# EAGLE design main_board (EAGLE 9.6.2)
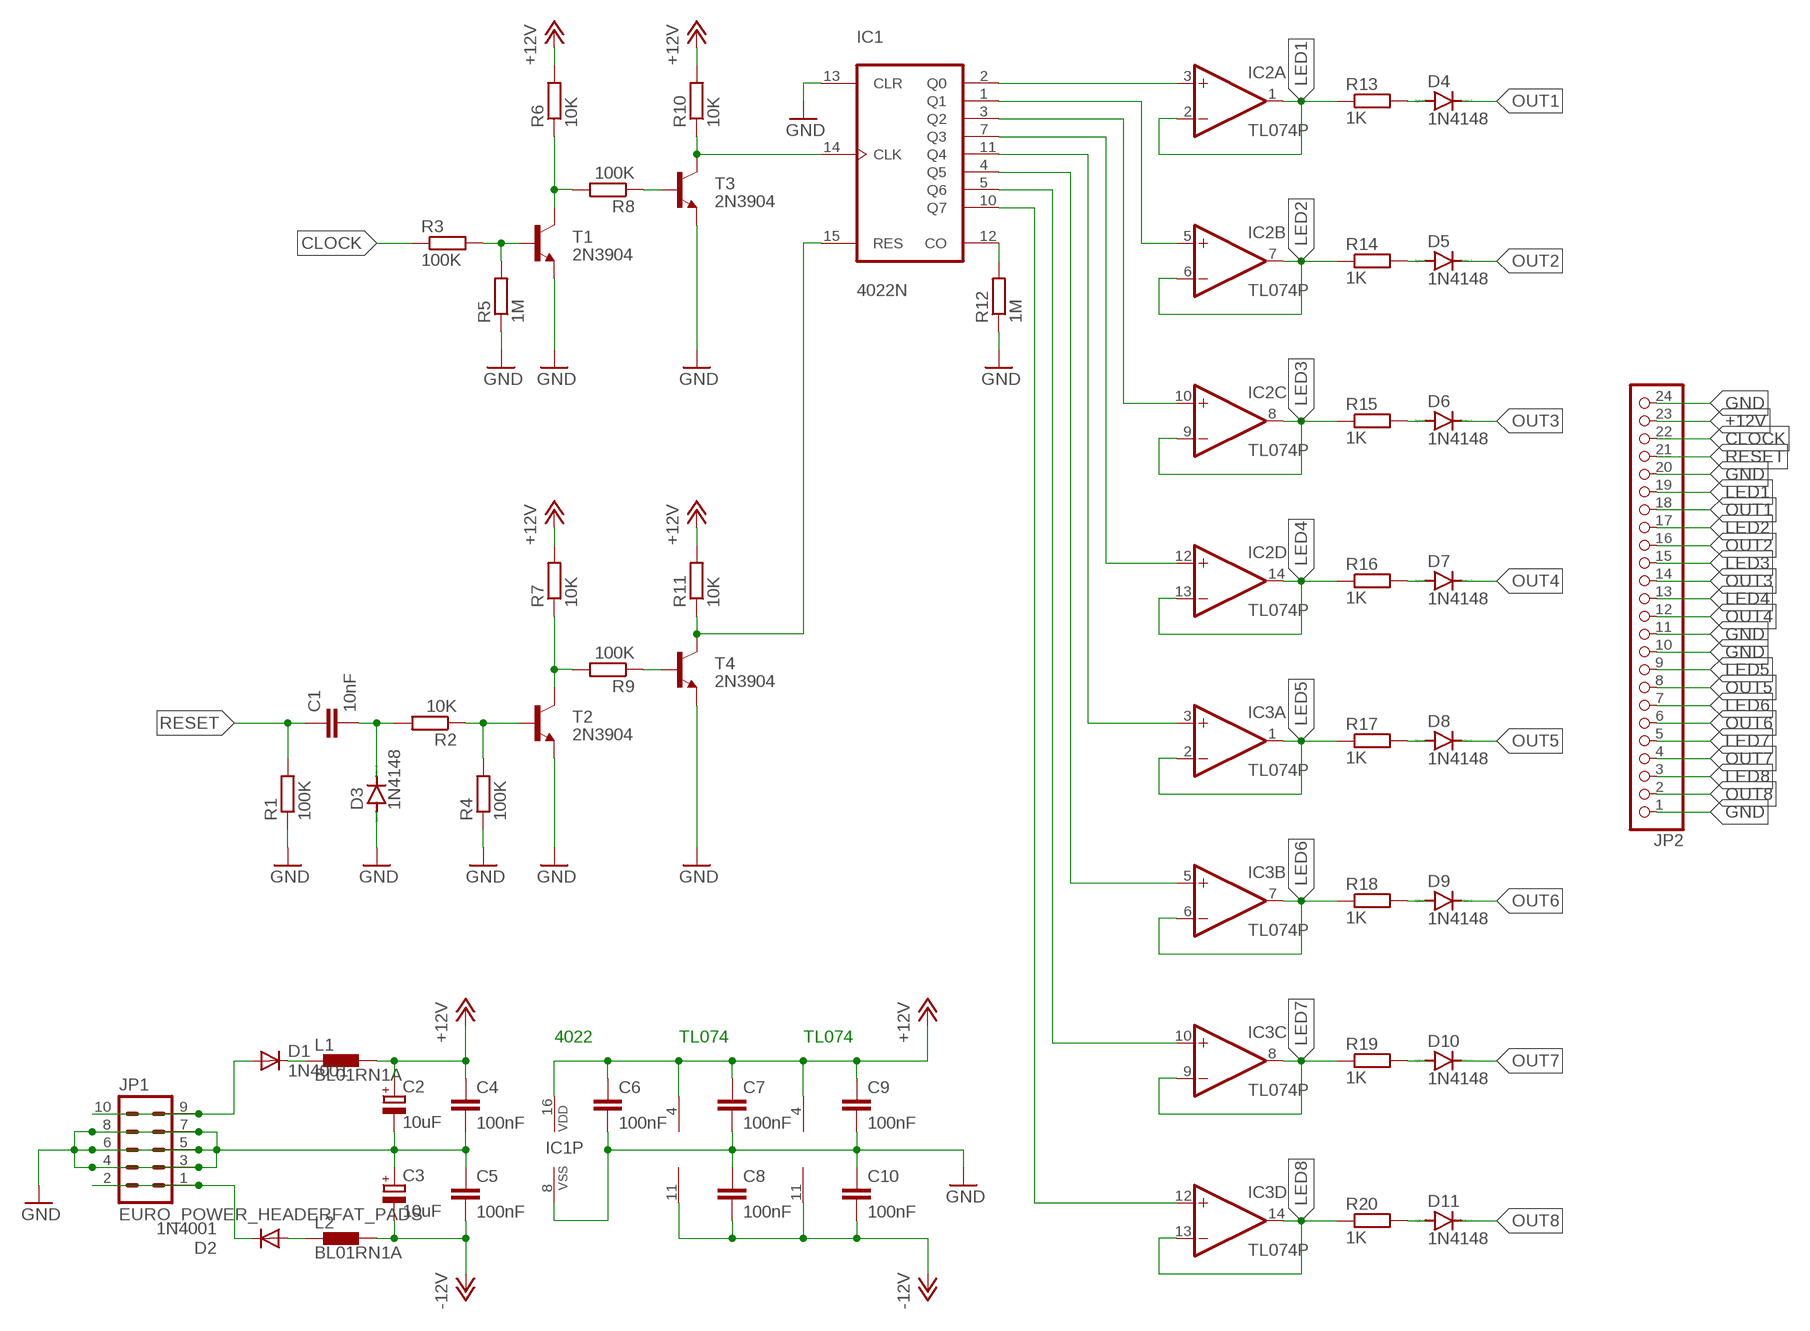
[diagram p0: schematic, sheet 1]

## Parts
C1  10nF  C-EU025-024X044  [C025-024X044]
C2  10uF  CPOL-EUE2,5-6E  [E2,5-6E]
C3  10uF  CPOL-EUE2,5-6E  [E2,5-6E]
C4  100nF  C-EU025-024X044  [C025-024X044]
C5  100nF  C-EU025-024X044  [C025-024X044]
C6  100nF  C-EU025-024X044  [C025-024X044]
C7  100nF  C-EU025-024X044  [C025-024X044]
C8  100nF  C-EU025-024X044  [C025-024X044]
C9  100nF  C-EU025-024X044  [C025-024X044]
C10  100nF  C-EU025-024X044  [C025-024X044]
D1  1N4001  1N4004  [DO41-10]
D2  1N4001  1N4004  [DO41-10]
D3  1N4148  1N4148DO35-7  [DO35-7]
D4  1N4148  1N4148DO35-7  [DO35-7]
D5  1N4148  1N4148DO35-7  [DO35-7]
D6  1N4148  1N4148DO35-7  [DO35-7]
D7  1N4148  1N4148DO35-7  [DO35-7]
D8  1N4148  1N4148DO35-7  [DO35-7]
D9  1N4148  1N4148DO35-7  [DO35-7]
D10  1N4148  1N4148DO35-7  [DO35-7]
D11  1N4148  1N4148DO35-7  [DO35-7]
IC1  4022N  [DIL16]
IC2  TL074P  [DIL14]
IC3  TL074P  [DIL14]
JP1  EURO_POWER_HEADERFAT_PADS  [EURO_PWR_HEADER_FAT]
JP2  PINHD-1X24/90  [1X24/90]
L1  BL01RN1A  [BL01RN1A]
L2  BL01RN1A  [BL01RN1A]
R1  100K  R-EU_0204/5  [0204/5]
R2  10K  R-EU_0204/5  [0204/5]
R3  100K  R-EU_0204/5  [0204/5]
R4  100K  R-EU_0204/5  [0204/5]
R5  1M  R-EU_0204/5  [0204/5]
R6  10K  R-EU_0204/5  [0204/5]
R7  10K  R-EU_0204/5  [0204/5]
R8  100K  R-EU_0204/5  [0204/5]
R9  100K  R-EU_0204/5  [0204/5]
R10  10K  R-EU_0204/5  [0204/5]
R11  10K  R-EU_0204/5  [0204/5]
R12  1M  R-EU_0204/5  [0204/5]
R13  1K  R-EU_0204/5  [0204/5]
R14  1K  R-EU_0204/5  [0204/5]
R15  1K  R-EU_0204/5  [0204/5]
R16  1K  R-EU_0204/5  [0204/5]
R17  1K  R-EU_0204/5  [0204/5]
R18  1K  R-EU_0204/5  [0204/5]
R19  1K  R-EU_0204/5  [0204/5]
R20  1K  R-EU_0204/5  [0204/5]
T1  2N3904  [TO92]
T2  2N3904  [TO92]
T3  2N3904  [TO92]
T4  2N3904  [TO92]

## Nets
+12V: C2.+ C4.1 C6.1 C7.1 C9.1 IC1.16(VDD) IC2.4(P:V+) IC3.4(P:V+) JP2.23 L1.2 R6.2 R7.2 R10.2 R11.2
-12V: C3.- C5.2 C8.2 C10.2 IC2.11(P:V-) IC3.11(P:V-) L2.2
CLOCK: JP2.22 R3.1
GND: C2.- C3.+ C4.2 C5.1 C6.2 C7.2 C8.1 C9.2 C10.1 D3.A IC1.8(VSS) IC1.13(CLR) JP1.3 JP1.4 JP1.5 JP1.6 JP1.7 JP1.8 JP2.1 JP2.10 JP2.11 JP2.20 JP2.24 R1.1 R4.1 R5.1 R12.1 T1.3(E) T2.3(E) T3.3(E) T4.3(E)
LED1: IC2.1(A:OUT) IC2.2(A:-IN) JP2.19 R13.1
LED2: IC2.6(B:-IN) IC2.7(B:OUT) JP2.17 R14.1
LED3: IC2.8(C:OUT) IC2.9(C:-IN) JP2.15 R15.1
LED4: IC2.13(D:-IN) IC2.14(D:OUT) JP2.13 R16.1
LED5: IC3.1(A:OUT) IC3.2(A:-IN) JP2.9 R17.1
LED6: IC3.6(B:-IN) IC3.7(B:OUT) JP2.7 R18.1
LED7: IC3.8(C:OUT) IC3.9(C:-IN) JP2.5 R19.1
LED8: IC3.13(D:-IN) IC3.14(D:OUT) JP2.3 R20.1
N$1: D1.A JP1.9 JP1.10
N$2: D2.C JP1.1 JP1.2
N$3: D1.C L1.1
N$4: D2.A L2.1
N$5: D4.A R13.2
N$7: D5.A R14.2
N$11: D6.A R15.2
N$16: D7.A R16.2
N$17: IC1.2(Q0) IC2.3(A:+IN)
N$18: IC1.1(Q1) IC2.5(B:+IN)
N$19: IC1.3(Q2) IC2.10(C:+IN)
N$20: IC1.7(Q3) IC2.12(D:+IN)
N$21: IC1.11(Q4) IC3.3(A:+IN)
N$22: IC1.4(Q5) IC3.5(B:+IN)
N$23: IC1.5(Q6) IC3.10(C:+IN)
N$24: IC1.10(Q7) IC3.12(D:+IN)
N$26: R3.2 R5.2 T1.2(B)
N$28: C1.2 D3.C R2.2
N$29: R2.1 R4.2 T2.2(B)
N$30: R6.1 R8.2 T1.1(C)
N$32: IC1.12(CO) R12.2
N$37: D8.A R17.2
N$41: D9.A R18.2
N$45: D10.A R19.2
N$49: D11.A R20.2
N$52: R8.1 T3.2(B)
N$53: IC1.14(CLK) R10.1 T3.1(C)
N$54: R7.1 R9.2 T2.1(C)
N$55: R9.1 T4.2(B)
N$56: IC1.15(RES) R11.1 T4.1(C)
OUT1: D4.C JP2.18
OUT2: D5.C JP2.16
OUT3: D6.C JP2.14
OUT4: D7.C JP2.12
OUT5: D8.C JP2.8
OUT6: D9.C JP2.6
OUT7: D10.C JP2.4
OUT8: D11.C JP2.2
RESET: C1.1 JP2.21 R1.2

## Notes on the sheet
- 4022 | TL074 | TL074

## Library data of the parts
C1 = rcl:C-EU: CAPACITOR, European symbol; MF: MULTICOMP; MPN: MC0805Y103M500A2.54MM; OC_FARNELL: 1694335; SPICEPREFIX: C
C2 C3 = rcl:CPOL-EU: POLARIZED CAPACITOR, European symbol; MF: RUBYCON; MPN: 35ZLG10MEFC5X7; OC_FARNELL: 1281818; SPICEPREFIX: C
C4-C10 = rcl:C-EU: CAPACITOR, European symbol; MF: EPCOS; MPN: B32529C0104J289; OC_FARNELL: 2797801; SPICEPREFIX: C
D1 D2 = diode:1N4004: DIODE general purpose rectifier, 1 A; MF: VISHAY; MPN: 1N4001-E3/54; OC_FARNELL: 2889052
D3-D11 = diode:1N4148: DIODE high speed (Philips); MF: DIODES INC.; MPN: 1N5817-T; OC_FARNELL: 3127178
IC1 = 40xx:4022: Divide-by 8 COUNTER; MF: TEXAS INSTRUMENTS; MPN: CD4022BE; OC_FARNELL: 3006269
IC2 IC3 = linear:TL074: OP AMP; MF: TEXAS INSTRUMENTS; MPN: TL074ACN; OC_FARNELL: 3117798
JP1 = MusicThingModular:EURO_POWER_HEADER: Power Header 10 pin power header for Eurorack Power Supplies Variants with fatter pads for easier soldering, and the LOCK variant which has 5mil offset pins to hold the component in place before soldering
JP2 = pinhead:PINHD-1X24: PIN HEADER
L1 L2 = inductors:BL0: Noise Suppression Products/EMI Suppression Filters, Lead EMIFIL(R) Inductor Type Source: http://www.murata.com .. BL01RN1_DS.pdf
R1 R3 R4 R8 R9 = rcl:R-EU_: RESISTOR, European symbol; MF: MULTICOMP PRO; MPN: MCF 0.25W 100K; OC_FARNELL: 9339078; SPICEPREFIX: R
R2 R6 R7 R10 R11 = rcl:R-EU_: RESISTOR, European symbol; MF: MULTICOMP PRO; MPN: MCF 0.25W 10K; OC_FARNELL: 9339060; SPICEPREFIX: R
R5 R12 = rcl:R-EU_: RESISTOR, European symbol; MF: MULTICOMP PRO; MPN: MCF 0.25W 1M; OC_FARNELL: 9339086; SPICEPREFIX: R
R13-R20 = rcl:R-EU_: RESISTOR, European symbol; MF: MULTICOMP PRO; MPN: MCF 0.25W 1K; OC_FARNELL: 9339051; SPICEPREFIX: R
T1-T4 = transistor:2N3904: NPN TRANSISTOR; MF: MULTICOMP PRO; MPN: 2N3904; OC_FARNELL: 1574370

## Net classes
1 power: width 0.406 mm
2 ground: width 0.406 mm

## Board
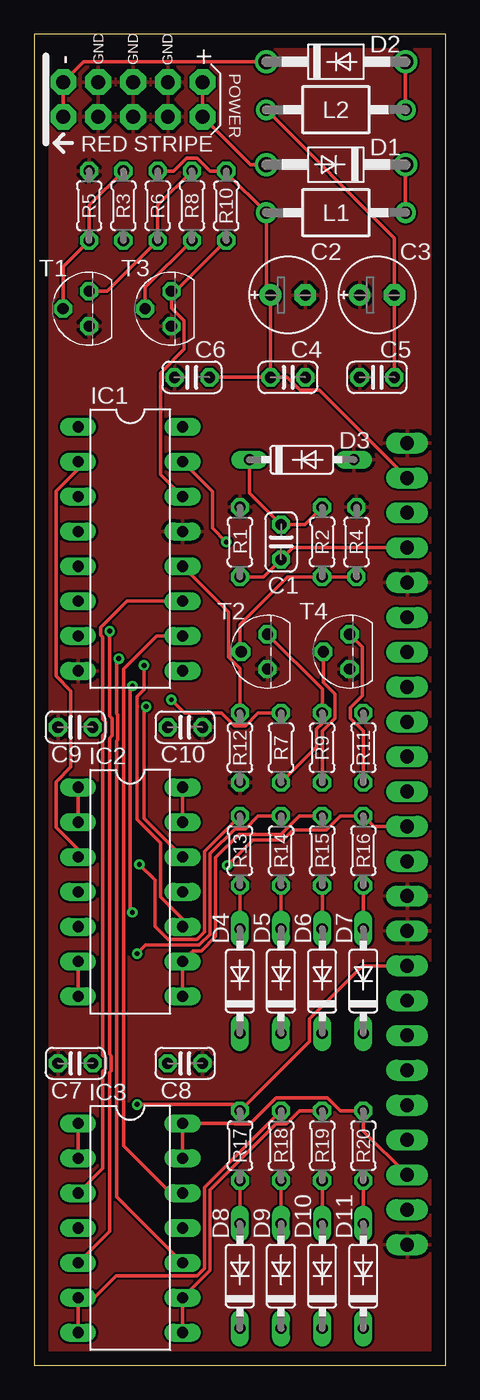
[diagram p1: board, top side]
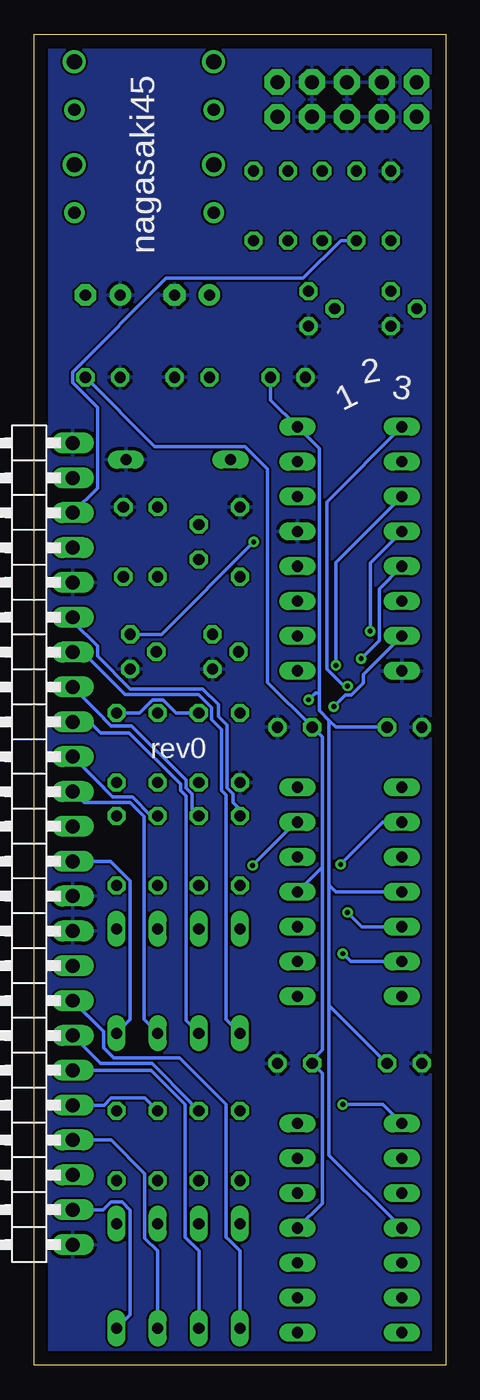
[diagram p2: board, bottom side, seen from below]

Size 30 x 97 mm. Coordinates in mm from the lower left corner, seen from the top.
Outline: 0,0 30,0 30,97 0,97 0,0
Copper layers (1*16): Top 0.035mm / dielectric 1.5mm / Bottom 0.035mm
Design rules "default *": minimum track width 6mil, minimum drill 0.35mm, track to track 6mil, track to pad 6mil, pad to pad 6mil, via to via 6mil, smd to smd 6mil, copper to edge 40mil, drill to drill 6mil, minimum pad ring 10mil, minimum via ring 8mil, stop-mask expansion 4mil, vias tented up to drill 0mil, thermal gap 10mil

### Footprints (pad centres in the part's own frame; a part is rotated, then mirrored left to right if it is on the bottom)
C025-024X044 = drill 0.813 octagon: 1 -1.27,0; 2 1.27,0
E2,5-6E = drill 0.813 pad 1.575: + -1.27,0 | drill 0.813 pad 1.575 octagon: - 1.27,0
DO41-10 = drill 1.118: A 5.08,0; C -5.08,0
DO35-7 = drill 0.813 long: A 3.81,0; C -3.81,0
DIL16 = drill 0.813 long: 1 -8.89,-3.81; 2 -6.35,-3.81; 3 -3.81,-3.81; 4 -1.27,-3.81; 5 1.27,-3.81; 6 3.81,-3.81; 7 6.35,-3.81; 8 8.89,-3.81; 9 8.89,3.81; 10 6.35,3.81; 11 3.81,3.81; 12 1.27,3.81; 13 -1.27,3.81; 14 -3.81,3.81; 15 -6.35,3.81; 16 -8.89,3.81
DIL14 = drill 0.813 long: 1 -7.62,-3.81; 2 -5.08,-3.81; 3 -2.54,-3.81; 4 0,-3.81; 5 2.54,-3.81; 6 5.08,-3.81; 7 7.62,-3.81; 8 7.62,3.81; 9 5.08,3.81; 10 2.54,3.81; 11 0,3.81; 12 -2.54,3.81; 13 -5.08,3.81; 14 -7.62,3.81
EURO_PWR_HEADER_FAT = drill 1.016 pad 1.88 octagon: 1 -5.08,-1.27; 2 -5.08,1.27; 3 -2.54,-1.27; 4 -2.54,1.27; 5 0,-1.27; 6 0,1.27; 7 2.54,-1.27; 8 2.54,1.27; 9 5.08,-1.27; 10 5.08,1.27
1X24/90 = drill 1.016 long: 1 -29.21,-3.81; 2 -26.67,-3.81; 3 -24.13,-3.81; 4 -21.59,-3.81; 5 -19.05,-3.81; 6 -16.51,-3.81; 7 -13.97,-3.81; 8 -11.43,-3.81; 9 -8.89,-3.81; 10 -6.35,-3.81; 11 -3.81,-3.81; 12 -1.27,-3.81; 13 1.27,-3.81; 14 3.81,-3.81; 15 6.35,-3.81; 16 8.89,-3.81; 17 11.43,-3.81; 18 13.97,-3.81; 19 16.51,-3.81; 20 19.05,-3.81; 21 21.59,-3.81; 22 24.13,-3.81; 23 26.67,-3.81; 24 29.21,-3.81
BL01RN1A = drill 0.9 pad 1.5: 1 -5.08,0; 2 5.08,0
0204/5 = drill 0.813 octagon: 1 -2.54,0; 2 2.54,0
TO92 = drill 0.813 octagon: 1 1.27,0; 2 0,1.905; 3 -1.27,0

### Placement (x,y rotation side)
C1  18,60 90 top
C2  18.5,78 0 top
C3  25,78 0 top
C4  18.5,72 0 top
C5  25,72 0 top
C6  11.5,72 180 top
C7  3,22 180 top
C8  11,22 180 top
C9  3,46.5 180 top
C10  11,46.5 180 top
D1  22,87.5 180 top
D2  22,95 0 top
D3  19.5,66 0 top
D4  15,28 90 top
D5  18,28 90 top
D6  21,28 90 top
D7  24,28 90 top
D8  15,6.5 90 top
D9  18,6.5 90 top
D10  21,6.5 90 top
D11  24,6.5 90 top
IC1  7,59.5 270 top
IC2  7,34.5 270 top
IC3  7,10 270 top
JP1  7.2,92.25 0 top
JP2  31,38 90 bottom
L1  22,84 180 top
L2  22,91.5 180 top
R1  15,60 270 top
R2  21,60 90 top
R3  6.5,84.5 90 top
R4  23.5,60 270 top
R5  4,84.5 270 top
R6  9,84.5 90 top
R7  18,45 90 top
R8  11.5,84.5 90 top
R9  21,45 90 top
R10  14,84.5 90 top
R11  24,45 90 top
R12  15,45 90 top
R13  15,37.5 270 top
R14  18,37.5 270 top
R15  21,37.5 270 top
R16  24,37.5 270 top
R17  15,16 270 top
R18  18,16 270 top
R19  21,16 270 top
R20  24,16 270 top
T1  4,77 90 top
T2  17,52 90 top
T3  10,77 90 top
T4  23,52 90 top

### Tracks (layer width: path | path; a pad name or v marks a point on that pad's centre or on a via)
+12V  (via drill 0.35)
  Top 0.254: R6.2 10.17,87.04 11.11,87.98 11.89,87.98 12.83,87.04 R10.2 14,86.92 L1.2 16.92,78.31 C2.+ C4.1 | C4.1 C6.1 | JP2.23 20.8,71.06 19.38,71.06 18.44,72 C4.1 | v10,48.5 10.96,47.54 13.67,47.54 14.61,46.6 15.39,46.6 16.33,47.54 R7.2
  Bottom 0.254: R7.2 19.67,47.54 20.61,48.48 21.39,48.48 22.33,47.54 R11.2 | IC3.4 8.5,15.31 8.5,26.23 | 8.5,47 8.5,35 | 8.5,35 8.5,26.23 | C7.1 8.5,26.23 | C9.1 8,46.5 8.5,47 | 8.5,47 9.21,47.71 9.21,49 | C6.1 12.77,70.35 IC1.16 9.21,66.79 9.21,49 | IC2.4 8,34.5 8.5,35 | v10,48.5 9.5,49 9.21,49
-12V
  Top 0.254: L2.2 26.27,82.15 C3.- C5.2
  Bottom 0.254: IC3.11 9,11.81 9,21.27 C8.2 9.73,22.27 9,23 9,36.31 | 9,36.31 9,45.77 C10.2 13,49.77 13,65.3 14.64,66.94 21.21,66.94 C5.2 | IC2.11 9,36.31
CLOCK
  Bottom 0.254: R3.1 7.64,81.96 10.39,79.21 20.39,79.21 27.21,72.39 27.21,71.61 25.39,69.79 25.39,63.93 JP2.22
GND
  pour Top: -1,98 -1,-1 31,-1 31,98
  pour Bottom: -1,98 -1,-1 31,-1 31,98
LED1  (via drill 0.35)
  Top 0.254: IC2.2 IC2.1 | v7.66,36.5 8.8,35.35 8.8,31.98 9.76,31.02 11.86,31.02 12.41,31.57 12.41,37.45 R13.1
  Bottom 0.254: IC2.2 4.58,39.58 v7.66,36.5 | R13.1 15,40.5 15.5,41 15.5,41.63 15.94,42.07 15.94,46.65 16.56,47.27 16.56,48.14 17.72,49.29 23,49.29 25.39,51.68 25.39,52.4 27.19,54.2 JP2.19
LED2  (via drill 0.35)
  Top 0.254: IC2.6 IC2.7 | v7.5,30 8.11,30.61 12.03,30.61 12.82,31.4 12.82,37.28 14.63,39.1 15.39,39.1 16.33,40.04 R14.1
  Bottom 0.254: IC2.6 6.92,29.42 v7.5,30 | R14.1 18.5,40.54 18.5,41.63 18.94,42.07 18.94,42.65 22.89,46.6 24.39,46.6 24.94,47.15 24.94,47.18 JP2.17
LED3
  Top 0.254: IC2.8 IC2.9 11.6,30.21 12.2,30.21 13.22,31.23 13.22,37 14.92,38.69 17.98,38.69 19.33,40.04 R15.1
  Bottom 0.254: R15.1 21.46,40.04 22.83,41.41 24.27,41.41 24.94,42.07 24.94,42.1 JP2.15
LED4  (via drill 0.35)
  Top 0.254: IC2.13 IC2.14 | v14.08,36.42 15.94,38.29 18.15,38.29 18.86,39 21.29,39 22.33,40.04 R16.1 24.77,39.27 JP2.13
  Bottom 0.254: IC2.13 10.92,39.58 v14.08,36.42
LED5  (via drill 0.35)
  Top 0.254: IC3.1 IC3.2 | v7.5,19 14.54,19 R17.1 20.06,23.6 20.06,25.24 23.93,29.11 JP2.9
  Bottom 0.254: IC3.1 4.57,19 v7.5,19
LED6
  Top 0.254: IC3.7 IC3.6 4.38,4.92 5.98,6.52 11.86,6.52 12.41,7.07 12.41,12.95 R18.1
  Bottom 0.254: R18.1 18.59,19.13 18.59,19.17 21.43,22 25.16,22 JP2.7
LED7
  Top 0.254: IC3.8 IC3.9 12,6.11 12.03,6.11 12.82,6.9 12.82,12.78 17.64,17.6 18.39,17.6 19.33,18.54 R19.1
  Bottom 0.254: JP2.5 24.92,18.95 24.39,19.48 21.94,19.48 R19.1
LED8
  Top 0.254: IC3.13 IC3.14 14.59,17.62 14.61,17.6 15.73,17.6 17.61,19.48 21.39,19.48 22.33,18.54 R20.1 24,17.06 JP2.3
N$1
  Top 0.254: JP1.10 JP1.9 15.76,87.5 D1.A
N$2
  Top 0.254: JP1.1 JP1.2 3.6,95 D2.C
N$3
  Top 0.254: D1.C L1.1
N$4
  Top 0.254: D2.A L2.1
N$5
  Top 0.254: R13.2 D4.A
N$7
  Top 0.254: R14.2 D5.A
N$11
  Top 0.254: R15.2 D6.A
N$16
  Top 0.254: R16.2 D7.A
N$17
  Top 0.254: IC2.3 3.19,37.59 1.59,39.19 1.59,42.51 2.67,43.59 2.67,49.14 1.59,50.22 1.59,63.7 3.19,65.3 IC1.2
N$18  (via drill 0.35)
  Top 0.254: v7.16,49.5 7,49.34 7,33.16 v7.16,33
  Bottom 0.254: IC1.1 8.66,62.92 8.66,50.73 7.43,49.5 v7.16,49.5 | IC2.5 6.12,31.96 v7.16,33
N$19  (via drill 0.35)
  Top 0.254: v8,51 8,49.25 7.5,48.75 7.5,39.77 9.21,38.06 9.21,34.11 10.81,32.51 IC2.10
  Bottom 0.254: v8,51 8,58.5 IC1.3
N$20  (via drill 0.35)
  Top 0.254: IC2.12 8,39.85 8,47.75 8.16,47.9 v8.16,48
  Bottom 0.254: v8.16,48 7.32,48.84 6.88,48.84 6,49.73 6,50.34 IC1.7
N$21
  Top 0.254: IC3.3 5,14.35 5,21.4 5.21,21.61 5.21,22.39 5,22.6 5,45.9 5.21,46.11 5.21,46.89 5,47.1 5,53.07 4.84,53.23 4.84,53.77 6.76,55.69 IC1.11
N$22  (via drill 0.35)
  Top 0.254: IC3.5 5.5,9.77 5.5,21.33 5.62,21.44 5.62,22.56 5.5,22.67 5.5,45.69 5.69,45.88 5.69,47.12 5.5,47.31 v5.5,53.5
  Bottom 0.254: v5.5,53.5 5.5,58.46 IC1.4
N$23  (via drill 0.35)
  Top 0.254: IC3.10 6,12.27 6,21.25 6.02,21.27 6.02,22.73 6,22.75 6,45.49 6.09,45.58 6.09,47.42 6,47.51 6,51.34 v6.16,51.5
  Bottom 0.254: IC1.5 4.84,56.58 4.84,52.81 v6.16,51.5
N$24
  Top 0.254: IC3.12 9.96,12.54 6.5,16 6.5,50.75 8.9,53.15 IC1.10
N$26
  Top 0.254: R3.2 4,84.54 R5.2 2.1,80.06 T1.2
N$28
  Top 0.254: R2.2 19.73,61.27 C1.2 15.69,63.58 D3.C
N$29
  Top 0.254: R4.2 R2.1 18.46,57.46 15,54 15,52.09 T2.2
N$30
  Top 0.254: R8.2 9,84.54 R6.1 5.31,78.27 T1.1
N$32
  Top 0.254: R12.2 15,50.77 14.15,51.61 14.15,54.88 IC1.12
N$37
  Top 0.254: R17.2 D8.A
N$41
  Top 0.254: R18.2 D9.A
N$45
  Top 0.254: R19.2 D10.A
N$49
  Top 0.254: R20.2 D11.A
N$52
  Top 0.254: R8.1 8.1,78.56 T3.2
N$53
  Top 0.254: R10.1 10.31,78.27 T3.1 10,77.06 10.94,76.12 10.94,74.04 9.21,72.31 9.21,64.91 IC1.14
N$54
  Top 0.254: T2.1 21,49.27 R9.2 21,46.79 20.59,46.38 20.59,45.05 R7.1
N$55
  Top 0.254: R9.1 21,46.21 21.94,47.15 21.94,48.91 21.09,49.75 T4.2
N$56  (via drill 0.35)
  Top 0.254: R11.1 24,46.21 23.06,47.15 23.06,47.93 23.94,48.81 23.94,52.33 T4.1 | v14,60 13,61 13,63.66 IC1.15
  Bottom 0.254: T4.1 20.73,53.27 v14,60
OUT1
  Bottom 0.254: D4.C 16,25.19 16,41.56 16.35,41.9 16.35,46.35 17.06,47.06 17.06,47.93 18.02,48.89 23.39,48.89 26.47,51.97 JP2.18
OUT2
  Bottom 0.254: JP2.16 25.96,46.89 25.17,46.09 23.09,46.09 19.35,42.35 19.35,41.9 18.94,41.5 18.94,25.13 D5.C
OUT3
  Bottom 0.254: D6.C 22,25.19 22,40 23,41 26.38,41 JP2.14
OUT4
  Bottom 0.254: D7.C 23,25.19 23,35.29 24.44,36.73 JP2.12
OUT5
  Bottom 0.254: D8.C 15,8.32 15.84,9.16 15.94,9.26 16,9.32 16,19 19.41,22.41 24.21,22.41 24.94,23.14 24.94,24.32 JP2.8
OUT6
  Bottom 0.254: D9.C 18,8.32 19,9.32 19,19 21.49,21.49 JP2.6
OUT7
  Bottom 0.254: D10.C 21,8.32 21.94,9.26 21.94,13.94 24.41,16.41 JP2.4
OUT8
  Bottom 0.254: D11.C 23,3.69 23,11.3 23.61,11.91 24.39,11.91 24.97,11.33 JP2.2
RESET
  Top 0.254: R1.2 16.73,57.46 C1.1 18.86,59.59 JP2.21

### Text on the board
bPlace: nagasaki45 | 2 | 3 | 1 | rev0